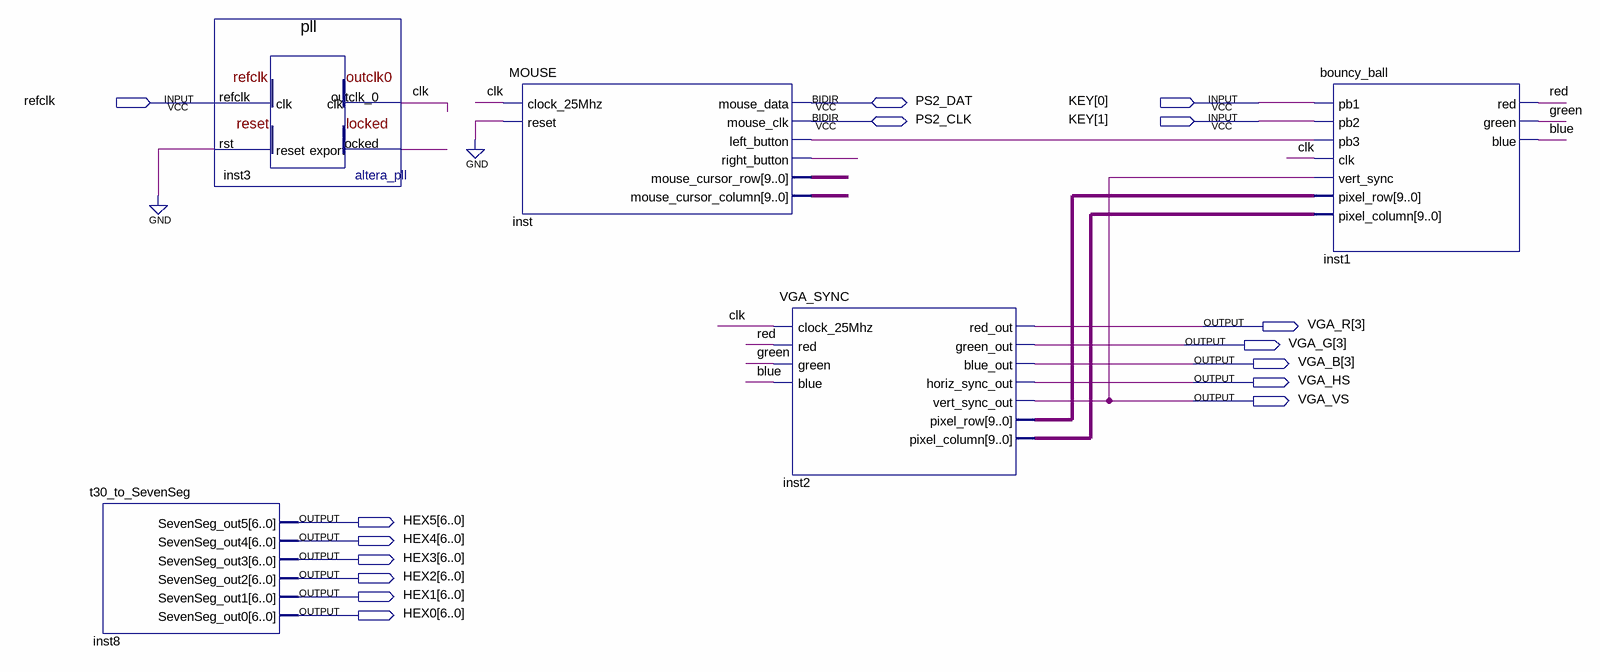
[diagram p0: schematic sheet]
// Quartus schematic BallAndMouse_DUT.bdf as structural Verilog: 5 symbols, 16 pins
module BallAndMouse_DUT (
  input  refclk,
  input  [1:0] KEY,
  inout  PS2_DAT,
  inout  PS2_CLK,
  output [3:3] VGA_R,
  output [3:3] VGA_G,
  output [3:3] VGA_B,
  output VGA_HS,
  output VGA_VS,
  output [6:0] HEX5,
  output [6:0] HEX4,
  output [6:0] HEX3,
  output [6:0] HEX2,
  output [6:0] HEX1,
  output [6:0] HEX0
);

  wire blue, clk, green, inst3_locked, inst_left_button, inst_right_button, red;
  wire [9:0] inst2_pixel_column, inst2_pixel_row, inst_mouse_cursor_column, inst_mouse_cursor_row;

  t30_to_SevenSeg inst8 (
    .SevenSeg_out5(HEX5), .SevenSeg_out4(HEX4), .SevenSeg_out3(HEX3), .SevenSeg_out2(HEX2),
    .SevenSeg_out1(HEX1), .SevenSeg_out0(HEX0));
  pll inst3 (.refclk(refclk), .rst(1'b0), .outclk_0(clk), .locked(inst3_locked));
  MOUSE inst (
    .clock_25Mhz(clk), .reset(1'b0), .left_button(inst_left_button), .right_button(inst_right_button),
    .mouse_cursor_row(inst_mouse_cursor_row), .mouse_cursor_column(inst_mouse_cursor_column),
    .mouse_data(PS2_DAT), .mouse_clk(PS2_CLK));
  VGA_SYNC inst2 (
    .clock_25Mhz(clk), .red(red), .green(green), .blue(blue), .red_out(VGA_R[3]), .green_out(VGA_G[3]),
    .blue_out(VGA_B[3]), .horiz_sync_out(VGA_HS), .vert_sync_out(VGA_VS), .pixel_row(inst2_pixel_row),
    .pixel_column(inst2_pixel_column));
  bouncy_ball inst1 (
    .pb1(KEY[0]), .pb2(KEY[1]), .pb3(inst_left_button), .clk(clk), .vert_sync(VGA_VS),
    .pixel_row(inst2_pixel_row), .pixel_column(inst2_pixel_column), .red(red), .green(green), .blue(blue));
endmodule
